# Altium schematic sheet aelde_mobileRobot_remake_jetson_esp32__hardware__SCH_mobile-robot-สสว_2024-02-27.schdoc
size 183 x 156 mm
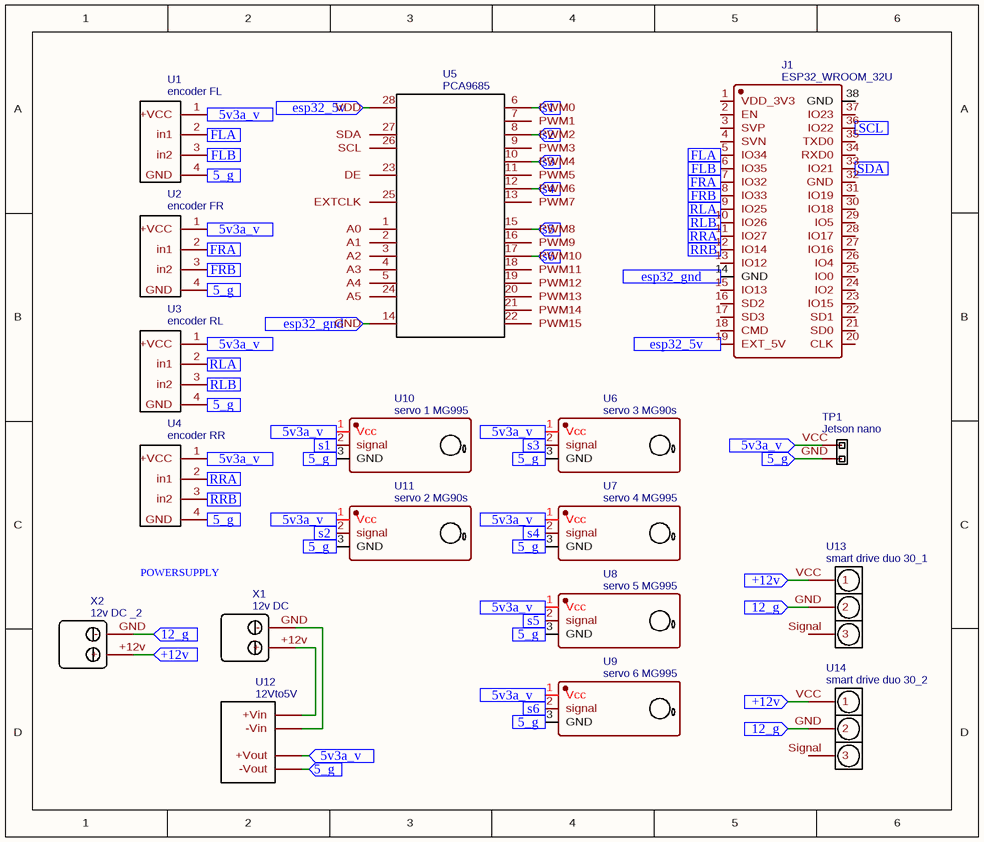
[diagram p0: aelde_mobileRobot_remake_jetson_esp32__hardware__SCH_mobile-robot-สสว_2024-02-27.schdoc]

## Parts
J1  ESP32_WROOM_32U  [ESP32_WROOM_32U]
TP1  Jetson nano  [2PIN-DIP]
U1  encoder FL  [CONNECTOR4PIN]
U2  encoder FR  [CONNECTOR4PIN]
U3  encoder RL  [CONNECTOR4PIN]
U4  encoder RR  [CONNECTOR4PIN]
U5  PCA9685  [TSSOP-28_L9.7-W4.4-P0.65-LS6.4-BL]
U6  servo 3 MG90s
U7  servo 4 MG995
U8  servo 5 MG995
U9  servo 6 MG995
U10  servo 1 MG995
U11  servo 2 MG90s
U12  12Vto5V
U13  smart drive duo 30_1  [10MM_SCREWTERMINAL_3P]
U14  smart drive duo 30_2  [10MM_SCREWTERMINAL_3P]
X1  12v DC  [2P TERMINAL SCREW BLOCK]
X2  12v DC _2  [2P TERMINAL SCREW BLOCK]

## Ports
5_g (in), 5v3a_v (in), 12_g (in), +12v (in), esp32_5v (in), esp32_gnd (in), FLA (in), FLB (in), FRA (in), FRB (in), RLA (in), RLB (in), RRA (in), RRB (in), s1 (in), s2 (in), s3 (in), s4 (in), s5 (in), s6 (in), SCL (in), SDA (in)

## Nets
5_g: TP1.GND U1.4(GND) U2.4(GND) U3.4(GND) U4.4(GND) U6.3(GND) U7.3(GND) U8.3(GND) U9.3(GND) U10.3(GND) U11.3(GND) U12.4(-Vout) ; port 5_g
5v3a_v: TP1.VCC U1.1(+VCC) U2.1(+VCC) U3.1(+VCC) U4.1(+VCC) U6.1(Vcc) U7.1(Vcc) U8.1(Vcc) U9.1(Vcc) U10.1(Vcc) U11.1(Vcc) U12.3(+Vout) ; port 5v3a_v
12_g: U13.GND(2) U14.GND(2) X2.GND(-) ; port 12_g
+12v: U13.VCC(1) U14.VCC(1) X2.+12v(+) ; port +12v
esp32_5v: J1.19(EXT_5V) ; port esp32_5v
esp32_gnd: J1.14(GND) ; port esp32_gnd
FLA: J1.5(IO34) U1.2(in1) ; port FLA
FLB: J1.6(IO35) U1.3(in2) ; port FLB
FRA: J1.7(IO32) U2.2(in1) ; port FRA
FRB: J1.8(IO33) U2.3(in2) ; port FRB
RLA: J1.9(IO25) U3.2(in1) ; port RLA
RLB: J1.10(IO26) U3.3(in2) ; port RLB
RRA: J1.11(IO27) U4.2(in1) ; port RRA
RRB: J1.12(IO14) U4.3(in2) ; port RRB
s1: U10.2(signal) ; port s1
s2: U11.2(signal) ; port s2
s3: U6.2(signal) ; port s3
s4: U7.2(signal) ; port s4
s5: U8.2(signal) ; port s5
s6: U9.2(signal) ; port s6
SCL: J1.36(IO22) ; port SCL
SDA: J1.33(IO21) ; port SDA
NetU12_1: U12.1(+Vin) X1.+12v(+)
NetU12_2: U12.2(-Vin) X1.GND(-)

Not connected (* = marked no-connect by the designer): J1 1(VDD_3V3) 2(EN) 3(SVP) 4(SVN) 13(IO12) 15(IO13) 16(SD2) 17(SD3) 18(CMD) 20(CLK) 21(SD0) 22(SD1) 23(IO15) 24(IO2) 25(IO0) 26(IO4) 27(IO16) 28(IO17) 29(IO5) 30(IO18) 31(IO19) 32(GND) 34(RXD0) 35(TXD0) 37(IO23) 38(GND); U5 1(A0) 2(A1) 3(A2) 4(A3) 5(A4) 6(PWM0) 7(PWM1) 8(PWM2) 9(PWM3) 10(PWM4) 11(PWM5) 12(PWM6) 13(PWM7) 14(GND) 15(PWM8) 16(PWM9) 17(PWM10) 18(PWM11) 19(PWM12) 20(PWM13) 21(PWM14) 22(PWM15) 23(DE) 24(A5) 25(EXTCLK) 26(SCL) 27(SDA) 28(VDD); U13 Signal(3); U14 Signal(3)

## Notes on the sheet
- Labels drawn without touching a wire or pin: POWERSUPPLY

## Library data of the parts
J1 = ESP32_WROOM_32U: Contributor: Joint1k; spicePre: X; spiceSymbolName: ESP32_WROOM_32U
TP1 = Jetson nano: nameAlias: Model; catid: 20; Contributor: Alex386; sim: true; spicePre: X; spiceSymbolName: 2PIN
U1 = encoder FL: nameAlias: Model; catid: 20; Contributor: vlad_34; sim: true; spicePre: X; Supplier: vlad34; spiceSymbolName: connector4Pin
U2 = encoder FR: nameAlias: Model; catid: 20; Contributor: vlad_34; sim: true; spicePre: X; Supplier: vlad34; spiceSymbolName: connector4Pin
U3 = encoder RL: nameAlias: Model; catid: 20; Contributor: vlad_34; sim: true; spicePre: X; Supplier: vlad34; spiceSymbolName: connector4Pin
U4 = encoder RR: nameAlias: Model; catid: 20; Contributor: vlad_34; sim: true; spicePre: X; Supplier: vlad34; spiceSymbolName: connector4Pin
U5 = PCA9685: Manufacturer: NXP Semiconductors; nameAlias: Model; catid: 20; Contributor: jopagti; sim: true; spicePre: X; link: https://cdn-shop.adafruit.com/datasheets/PCA9685.pdf; spiceSymbolName: PCA9685
U6 = servo 3 MG90s: nameAlias: Model; catid: 20; Contributor: maytus udomlerd; sim: true; spicePre: X; spiceSymbolName: MG995
U7 = servo 4 MG995: nameAlias: Model; catid: 20; Contributor: maytus udomlerd; sim: true; spicePre: X; spiceSymbolName: MG995
U8 = servo 5 MG995: nameAlias: Model; catid: 20; Contributor: maytus udomlerd; sim: true; spicePre: X; spiceSymbolName: MG995
U9 = servo 6 MG995: nameAlias: Model; catid: 20; Contributor: maytus udomlerd; sim: true; spicePre: X; spiceSymbolName: MG995
U10 = servo 1 MG995: nameAlias: Model; catid: 20; Contributor: maytus udomlerd; sim: true; spicePre: X; spiceSymbolName: MG995
U11 = servo 2 MG90s: nameAlias: Model; catid: 20; Contributor: maytus udomlerd; sim: true; spicePre: X; spiceSymbolName: MG995
U12 = 12Vto5V: nameAlias: Model; catid: 20; Contributor: adrielgff; spicePre: X; spiceSymbolName: 12Vto5V
U13 = smart drive duo 30_1: nameAlias: Model; catid: 20; Contributor: Piet Kolkman; spicePre: X; spiceSymbolName: 10mm_screwterminal_3P
U14 = smart drive duo 30_2: nameAlias: Model; catid: 20; Contributor: Piet Kolkman; spicePre: X; spiceSymbolName: 10mm_screwterminal_3P
X1 = 12v DC: nameAlias: Model; catid: 20; Contributor: dbeaudry92; sim: true; spicePre: X; spiceSymbolName: 2PScrewTerminalBlock
X2 = 12v DC _2: nameAlias: Model; catid: 20; Contributor: dbeaudry92; sim: true; spicePre: X; spiceSymbolName: 2PScrewTerminalBlock